# EAGLE design dl-10 (EAGLE 4.16)
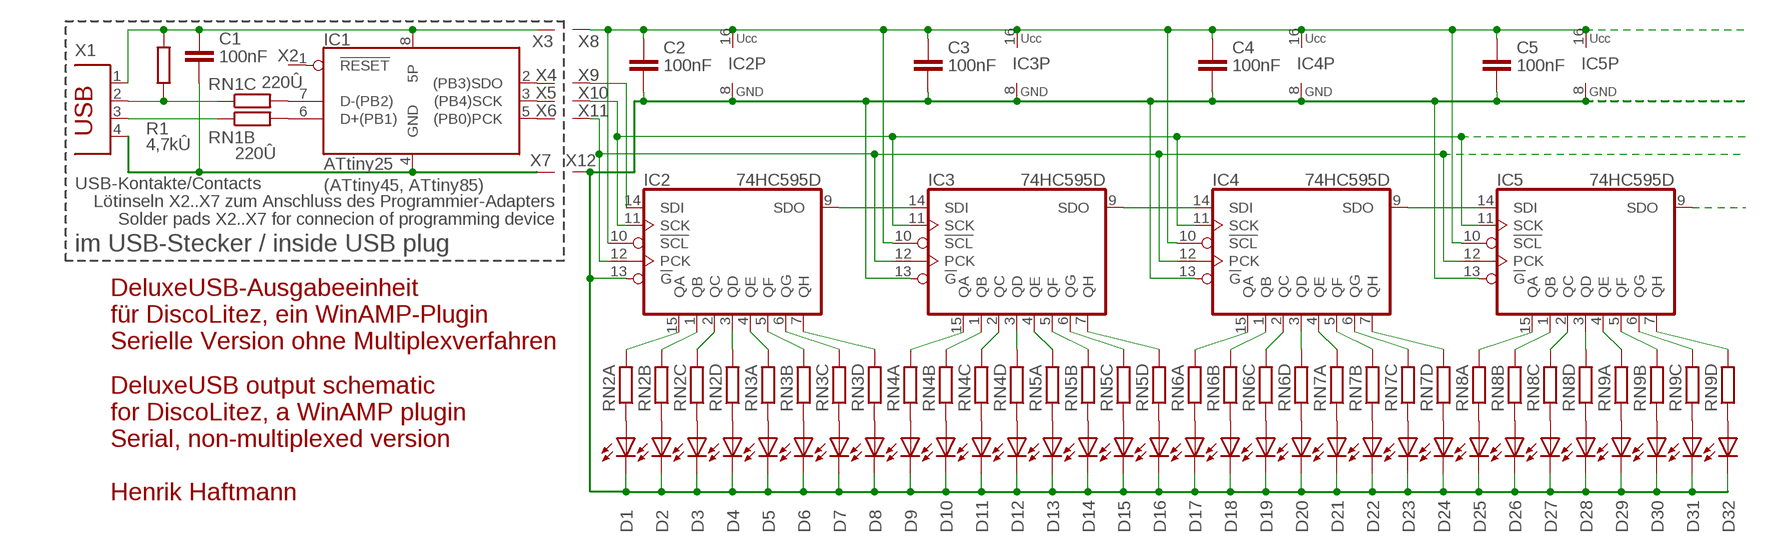
[diagram p0: schematic, sheet 1]

## Parts
C1  100nF  C  [0603]
C2  100nF  C  [0603]
C3  100nF  C  [0603]
C4  100nF  C  [0603]
C5  100nF  C  [0603]
D1  LED3MM  [LED3MM]
D2  LED3MM  [LED3MM]
D3  LED3MM  [LED3MM]
D4  LED3MM  [LED3MM]
D5  LED3MM  [LED3MM]
D6  LED3MM  [LED3MM]
D7  LED3MM  [LED3MM]
D8  LED3MM  [LED3MM]
D9  LED3MM  [LED3MM]
D10  LED3MM  [LED3MM]
D11  LED3MM  [LED3MM]
D12  LED3MM  [LED3MM]
D13  LED3MM  [LED3MM]
D14  LED3MM  [LED3MM]
D15  LED3MM  [LED3MM]
D16  LED3MM  [LED3MM]
D17  LED3MM  [LED3MM]
D18  LED3MM  [LED3MM]
D19  LED3MM  [LED3MM]
D20  LED3MM  [LED3MM]
D21  LED3MM  [LED3MM]
D22  LED3MM  [LED3MM]
D23  LED3MM  [LED3MM]
D24  LED3MM  [LED3MM]
D25  LED3MM  [LED3MM]
D26  LED3MM  [LED3MM]
D27  LED3MM  [LED3MM]
D28  LED3MM  [LED3MM]
D29  LED3MM  [LED3MM]
D30  LED3MM  [LED3MM]
D31  LED3MM  [LED3MM]
D32  LED3MM  [LED3MM]
IC1  ATtiny25  TINY25S  [SOIC8]
IC2  74HC595D  [SO16]
IC3  74HC595D  [SO16]
IC4  74HC595D  [SO16]
IC5  74HC595D  [SO16]
R1  4,7kÛ  R  [0603]
RN1  220Û  RN-4P1206  [R-4P]
RN2  RN-4P1206  [R-4P]
RN3  RN-4P1206  [R-4P]
RN4  RN-4P1206  [R-4P]
RN5  RN-4P1206  [R-4P]
RN6  RN-4P1206  [R-4P]
RN7  RN-4P1206  [R-4P]
RN8  RN-4P1206  [R-4P]
RN9  RN-4P1206  [R-4P]
X1  USB-Kontakte/Contacts  USB-A-DL  [USB-A-DL]
X2  PADM  [SMD-1MM5]
X3  PADM  [SMD-1MM5]
X4  PADM  [SMD-1MM5]
X5  PADM  [SMD-1MM5]
X6  PADM  [SMD-1MM5]
X7  PADM  [SMD-1MM5]
X8  PADS  [SMD-1MM]
X9  PADS  [SMD-1MM]
X10  PADS  [SMD-1MM]
X11  PADS  [SMD-1MM]
X12  PADS  [SMD-1MM]

## Nets
5P: C2.1 C3.1 C4.1 C5.1 IC2.10(!SCL) IC2.16(5P) IC3.10(!SCL) IC3.16(5P) IC4.10(!SCL) IC4.16(5P) IC5.10(!SCL) IC5.16(5P) X8.1
5P': C1.1 IC1.8(5P) R1.2 X1.1 X3.1
GND: C2.2 C3.2 C4.2 C5.2 D1.K D2.K D3.K D4.K D5.K D6.K D7.K D8.K D9.K D10.K D11.K D12.K D13.K D14.K D15.K D16.K D17.K D18.K D19.K D20.K D21.K D22.K D23.K D24.K D25.K D26.K D27.K D28.K D29.K D30.K D31.K D32.K IC2.8(GND) IC2.13(!G) IC3.8(GND) IC3.13(!G) IC4.8(GND) IC4.13(!G) IC5.8(GND) IC5.13(!G) X12.1
GND': C1.2 IC1.4(GND) X1.4 X7.1
N$1: IC1.7(D-(PB2)) RN1.6
N$2: IC1.6(D+(PB1)) RN1.7
N$3: R1.1 RN1.3 X1.2
N$4: RN1.2 X1.3
N$13: IC2.1(QB) RN2.7
N$14: IC2.15(QA) RN2.8
N$15: IC2.2(QC) RN2.6
N$16: IC2.3(QD) RN2.5
N$17: IC2.4(QE) RN3.8
N$18: IC3.15(QA) RN4.8
N$19: IC3.4(QE) RN5.8
N$20: IC4.15(QA) RN6.8
N$21: IC4.4(QE) RN7.8
N$22: IC5.15(QA) RN8.8
N$23: IC5.4(QE) RN9.8
N$24: IC2.5(QF) RN3.7
N$25: IC2.6(QG) RN3.6
N$26: IC2.7(QH) RN3.5
N$27: IC3.1(QB) RN4.7
N$28: IC3.2(QC) RN4.6
N$29: IC3.3(QD) RN4.5
N$30: IC3.5(QF) RN5.7
N$31: IC3.6(QG) RN5.6
N$32: IC3.7(QH) RN5.5
N$33: IC4.1(QB) RN6.7
N$34: IC4.2(QC) RN6.6
N$35: IC4.3(QD) RN6.5
N$36: IC4.5(QF) RN7.7
N$37: IC4.6(QG) RN7.6
N$38: IC4.7(QH) RN7.5
N$39: IC5.1(QB) RN8.7
N$40: IC5.2(QC) RN8.6
N$41: IC5.3(QD) RN8.5
N$42: IC5.5(QF) RN9.7
N$43: IC5.6(QG) RN9.6
N$44: IC5.7(QH) RN9.5
N$45: D1.A RN2.1
N$46: D2.A RN2.2
N$47: D3.A RN2.3
N$48: D4.A RN2.4
N$49: D5.A RN3.1
N$50: D6.A RN3.2
N$51: D7.A RN3.3
N$52: D8.A RN3.4
N$53: D9.A RN4.1
N$54: D10.A RN4.2
N$55: D11.A RN4.3
N$56: D12.A RN4.4
N$57: D13.A RN5.1
N$58: D14.A RN5.2
N$59: D15.A RN5.3
N$60: D16.A RN5.4
N$61: D17.A RN6.1
N$62: D18.A RN6.2
N$63: D19.A RN6.3
N$64: D20.A RN6.4
N$65: D21.A RN7.1
N$66: D22.A RN7.2
N$67: D23.A RN7.3
N$68: D24.A RN7.4
N$69: D25.A RN8.1
N$70: D26.A RN8.2
N$71: D27.A RN8.3
N$72: D28.A RN8.4
N$73: D29.A RN9.1
N$74: D30.A RN9.2
N$75: D31.A RN9.3
N$76: D32.A RN9.4
PCK: IC2.12(PCK) IC3.12(PCK) IC4.12(PCK) IC5.12(PCK) X11.1
PCK': IC1.5((PB0)PCK) X6.1
RESET: IC1.1(!RESET) X2.1
SCK: IC2.11(SCK) IC3.11(SCK) IC4.11(SCK) IC5.11(SCK) X10.1
SCK': IC1.3((PB4)SCK) X5.1
SDO0: IC2.14(SDI) X9.1
SDO1: IC2.9(SDO) IC3.14(SDI)
SDO2: IC3.9(SDO) IC4.14(SDI)
SDO3: IC4.9(SDO) IC5.14(SDI)
SDO4: IC5.9(SDO)
SDO': IC1.2((PB3)SDO) X4.1
Unconnected: RN1.1 RN1.4 RN1.5 RN1.8

## Notes on the sheet
- (ATtiny45, ATtiny85)
- Lötinseln X2..X7 zum Anschluss des Programmier-Adapters
- Solder pads X2..X7 for connecion of programming device
- im USB-Stecker / inside USB plug
- DeluxeUSB-Ausgabeeinheit
- für DiscoLitez, ein WinAMP-Plugin
- Serielle Version ohne Multiplexverfahren
- DeluxeUSB output schematic
- for DiscoLitez, a WinAMP plugin
- Serial, non-multiplexed version
- Henrik Haftmann

## Library data of the parts
C1-C5 = dl:C: Kondensator
D1-D32 = dl:LED: Leuchtdiode 2 Anschlüsse
IC1 = dl:TINY*5: 8-bit-Mikrocontroller Harvard-Architektur; hier Sonderdarstellung für DiscoLitez-Firmware. Hier wesentliche Features: 5 V Betriebsspannung interner RC-Oszillator mit 16,5 MHz Taktfrequenz 2/4/8 K Flash 128/256/512 Bytes RAM Watchdog-Timer Firmware basiert auf V-USB mit HID USB-konformer Schlafmodus mit < 1 µA Stromaufnahme passt in den USB-Stecker
IC2-IC5 = dl:74*595: Portexpander 8-bit-Schieberegister mit parallelen Ausgabe-Flipflops
R1 = dl:R: Widerstand
RN1-RN9 = dl:RN-4P: Widerstandsnetzwerk 4 Parallel
X1 = dl:USB-A-DL: USB-A-Stecker als Leiterplatten-Streifen Oberfläche sollte veredelt werden!
X2-X12 = dl:PAD: Einfaches Lötpad

## Board
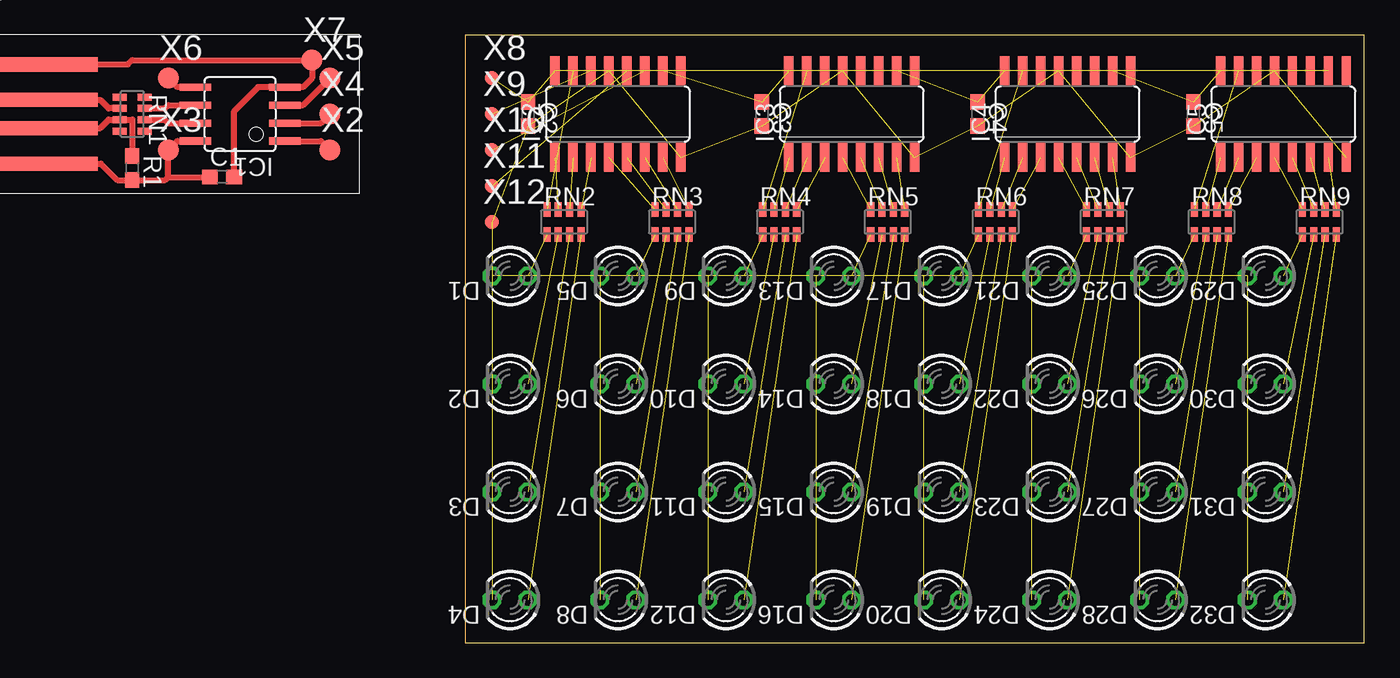
[diagram p1: board, top side]

Size 63.48 x 42.85 mm. Coordinates in mm from the lower left corner, seen from the top.
Outline: 0,0 63.48,0 63.48,42.85 0,42.85 0,0
Copper layers (1*16): Top 0.035mm / dielectric 1.5mm / Bottom 0.035mm
Design rules "default": minimum track width 10mil, minimum drill 24mil, track to track 8mil, track to pad 8mil, pad to pad 8mil, via to via 8mil, smd to smd 8mil, copper to edge 40mil, drill to drill 8mil, minimum pad ring 10mil, minimum via ring 8mil, stop-mask expansion 4mil, vias tented up to drill 0mil, thermal gap 10mil

### Footprints (pad centres in the part's own frame; a part is rotated, then mirrored left to right if it is on the bottom)
0603 = smd 1.1 x 1: 1 -0.85,0; 2 0.85,0
LED3MM = drill 0.813 octagon: A -1.27,0; K 1.27,0
SOIC8 = smd 0.5 x 2.2: 1 -1.905,-3.154; 2 -0.645,-3.154; 3 0.625,-3.154; 4 1.895,-3.154; 5 1.905,3.154; 6 0.635,3.154; 7 -0.635,3.154; 8 -1.905,3.154
SO16 = smd 0.66 x 2.032: 1 -4.445,-3.073; 2 -3.175,-3.073; 3 -1.905,-3.073; 4 -0.635,-3.073; 5 0.635,-3.073; 6 1.905,-3.073; 7 3.175,-3.073; 8 4.445,-3.073; 9 4.445,3.073; 10 3.175,3.073; 11 1.905,3.073; 12 0.635,3.073; 13 -0.635,3.073; 14 -1.905,3.073; 15 -3.175,3.073; 16 -4.445,3.073
R-4P = smd 0.5 x 1: 1 -1.2,-0.88; 2 -0.4,-0.88; 3 0.4,-0.88; 4 1.2,-0.88; 5 1.2,0.88; 6 0.4,0.88; 7 -0.4,0.88; 8 -1.2,0.88
USB-A-DL = smd 1 x 8: 1 3.5,5; 4 -3.5,5 | smd 1 x 7: 2 1,5.5; 3 -1,5.5
SMD-1MM5 = smd 1.5 x 1.5: 1 0,0
SMD-1MM = smd 1 x 1: 1 0,0

### Placement (x,y rotation side)
C1  -17.15,32.85 0 top  (outside the outline)
C2  4.44,37.3 270 top
C3  20.95,37.3 270 top
C4  36.19,37.3 270 top
C5  51.43,37.3 270 top
D1  3.17,25.87 180 top
D2  3.17,18.25 180 top
D3  3.17,10.63 180 top
D4  3.17,3.01 180 top
D5  10.79,25.87 180 top
D6  10.79,18.25 180 top
D7  10.79,10.63 180 top
D8  10.79,3.01 180 top
D9  18.41,25.87 180 top
D10  18.41,18.25 180 top
D11  18.41,10.63 180 top
D12  18.41,3.01 180 top
D13  26.03,25.87 180 top
D14  26.03,18.25 180 top
D15  26.03,10.63 180 top
D16  26.03,3.01 180 top
D17  33.65,25.87 180 top
D18  33.65,18.25 180 top
D19  33.65,10.63 180 top
D20  33.65,3.01 180 top
D21  41.27,25.87 180 top
D22  41.27,18.25 180 top
D23  41.27,10.63 180 top
D24  41.27,3.01 180 top
D25  48.89,25.87 180 top
D26  48.89,18.25 180 top
D27  48.89,10.63 180 top
D28  48.89,3.01 180 top
D29  56.51,25.87 180 top
D30  56.51,18.25 180 top
D31  56.51,10.63 180 top
D32  56.51,3.01 180 top
IC1  -15.88,37.3 90 top  (outside the outline)
IC2  10.79,37.3 0 top
IC3  27.3,37.3 0 top
IC4  42.54,37.3 0 top
IC5  57.78,37.3 0 top
R1  -23.5,33.49 270 top  (outside the outline)
RN1  -23.5,37.3 270 top  (outside the outline)
RN2  6.98,29.68 0 top
RN3  14.6,29.68 0 top
RN4  22.22,29.68 0 top
RN5  29.84,29.68 0 top
RN6  37.46,29.68 0 top
RN7  45.08,29.68 0 top
RN8  52.7,29.68 0 top
RN9  60.32,29.68 0 top
X1  -34.93,37.3 270 top  (outside the outline)
X2  -9.53,34.76 0 top  (outside the outline)
X3  -20.96,34.76 0 top  (outside the outline)
X4  -9.53,37.3 0 top  (outside the outline)
X5  -9.53,39.84 0 top  (outside the outline)
X6  -20.96,39.84 0 top  (outside the outline)
X7  -10.8,41.11 0 top  (outside the outline)
X8  1.9,39.84 0 top
X9  1.9,37.3 0 top
X10  1.9,34.76 0 top
X11  1.9,32.22 0 top
X12  1.9,29.68 0 top

### Tracks (layer width: path | path; a pad name or v marks a point on that pad's centre or on a via)
5P  (12 unrouted)
5P'
  Top 0.406: X1.1 -25.71,33.8 -24.55,32.64 R1.2 -21.17,32.64 -20.96,32.85 | IC1.8 -20.32,35.39 X3.1 -20.96,32.85 | -20.96,32.85 C1.1
GND  (44 unrouted)
GND'
  Top 0.406: X1.4 -23.81,40.8 -23.5,41.11 X7.1 -10.8,39.84 -11.45,39.2 IC1.4 -14.62,39.2 -16.3,37.52 C1.2
N$1
  Top 0.406: RN1.6 -21.2,36.9 -20.96,36.66 IC1.7
N$2
  Top 0.406: RN1.7 -21.2,37.7 -20.96,37.93 IC1.6
N$3
  Top 0.406: X1.2 -25.77,36.3 -25.17,36.9 RN1.3 -23.5,36.9 R1.1
N$4
  Top 0.406: X1.3 -25.77,38.3 -25.17,37.7 RN1.2
N$13  (1 unrouted)
N$14  (1 unrouted)
N$15  (1 unrouted)
N$16  (1 unrouted)
N$17  (1 unrouted)
N$18  (1 unrouted)
N$19  (1 unrouted)
N$20  (1 unrouted)
N$21  (1 unrouted)
N$22  (1 unrouted)
N$23  (1 unrouted)
N$24  (1 unrouted)
N$25  (1 unrouted)
N$26  (1 unrouted)
N$27  (1 unrouted)
N$28  (1 unrouted)
N$29  (1 unrouted)
N$30  (1 unrouted)
N$31  (1 unrouted)
N$32  (1 unrouted)
N$33  (1 unrouted)
N$34  (1 unrouted)
N$35  (1 unrouted)
N$36  (1 unrouted)
N$37  (1 unrouted)
N$38  (1 unrouted)
N$39  (1 unrouted)
N$40  (1 unrouted)
N$41  (1 unrouted)
N$42  (1 unrouted)
N$43  (1 unrouted)
N$44  (1 unrouted)
N$45  (1 unrouted)
N$46  (1 unrouted)
N$47  (1 unrouted)
N$48  (1 unrouted)
N$49  (1 unrouted)
N$50  (1 unrouted)
N$51  (1 unrouted)
N$52  (1 unrouted)
N$53  (1 unrouted)
N$54  (1 unrouted)
N$55  (1 unrouted)
N$56  (1 unrouted)
N$57  (1 unrouted)
N$58  (1 unrouted)
N$59  (1 unrouted)
N$60  (1 unrouted)
N$61  (1 unrouted)
N$62  (1 unrouted)
N$63  (1 unrouted)
N$64  (1 unrouted)
N$65  (1 unrouted)
N$66  (1 unrouted)
N$67  (1 unrouted)
N$68  (1 unrouted)
N$69  (1 unrouted)
N$70  (1 unrouted)
N$71  (1 unrouted)
N$72  (1 unrouted)
N$73  (1 unrouted)
N$74  (1 unrouted)
N$75  (1 unrouted)
N$76  (1 unrouted)
PCK  (4 unrouted)
PCK'
  Top 0.406: IC1.5 -20.32,39.2 X6.1
RESET
  Top 0.406: IC1.1 -10.16,35.39 X2.1
SCK  (4 unrouted)
SCK'
  Top 0.406: IC1.3 -11.45,37.92 X5.1
SDO0  (1 unrouted)
SDO1  (1 unrouted)
SDO2  (1 unrouted)
SDO3  (1 unrouted)
SDO'
  Top 0.406: IC1.2 -10.18,36.65 X4.1